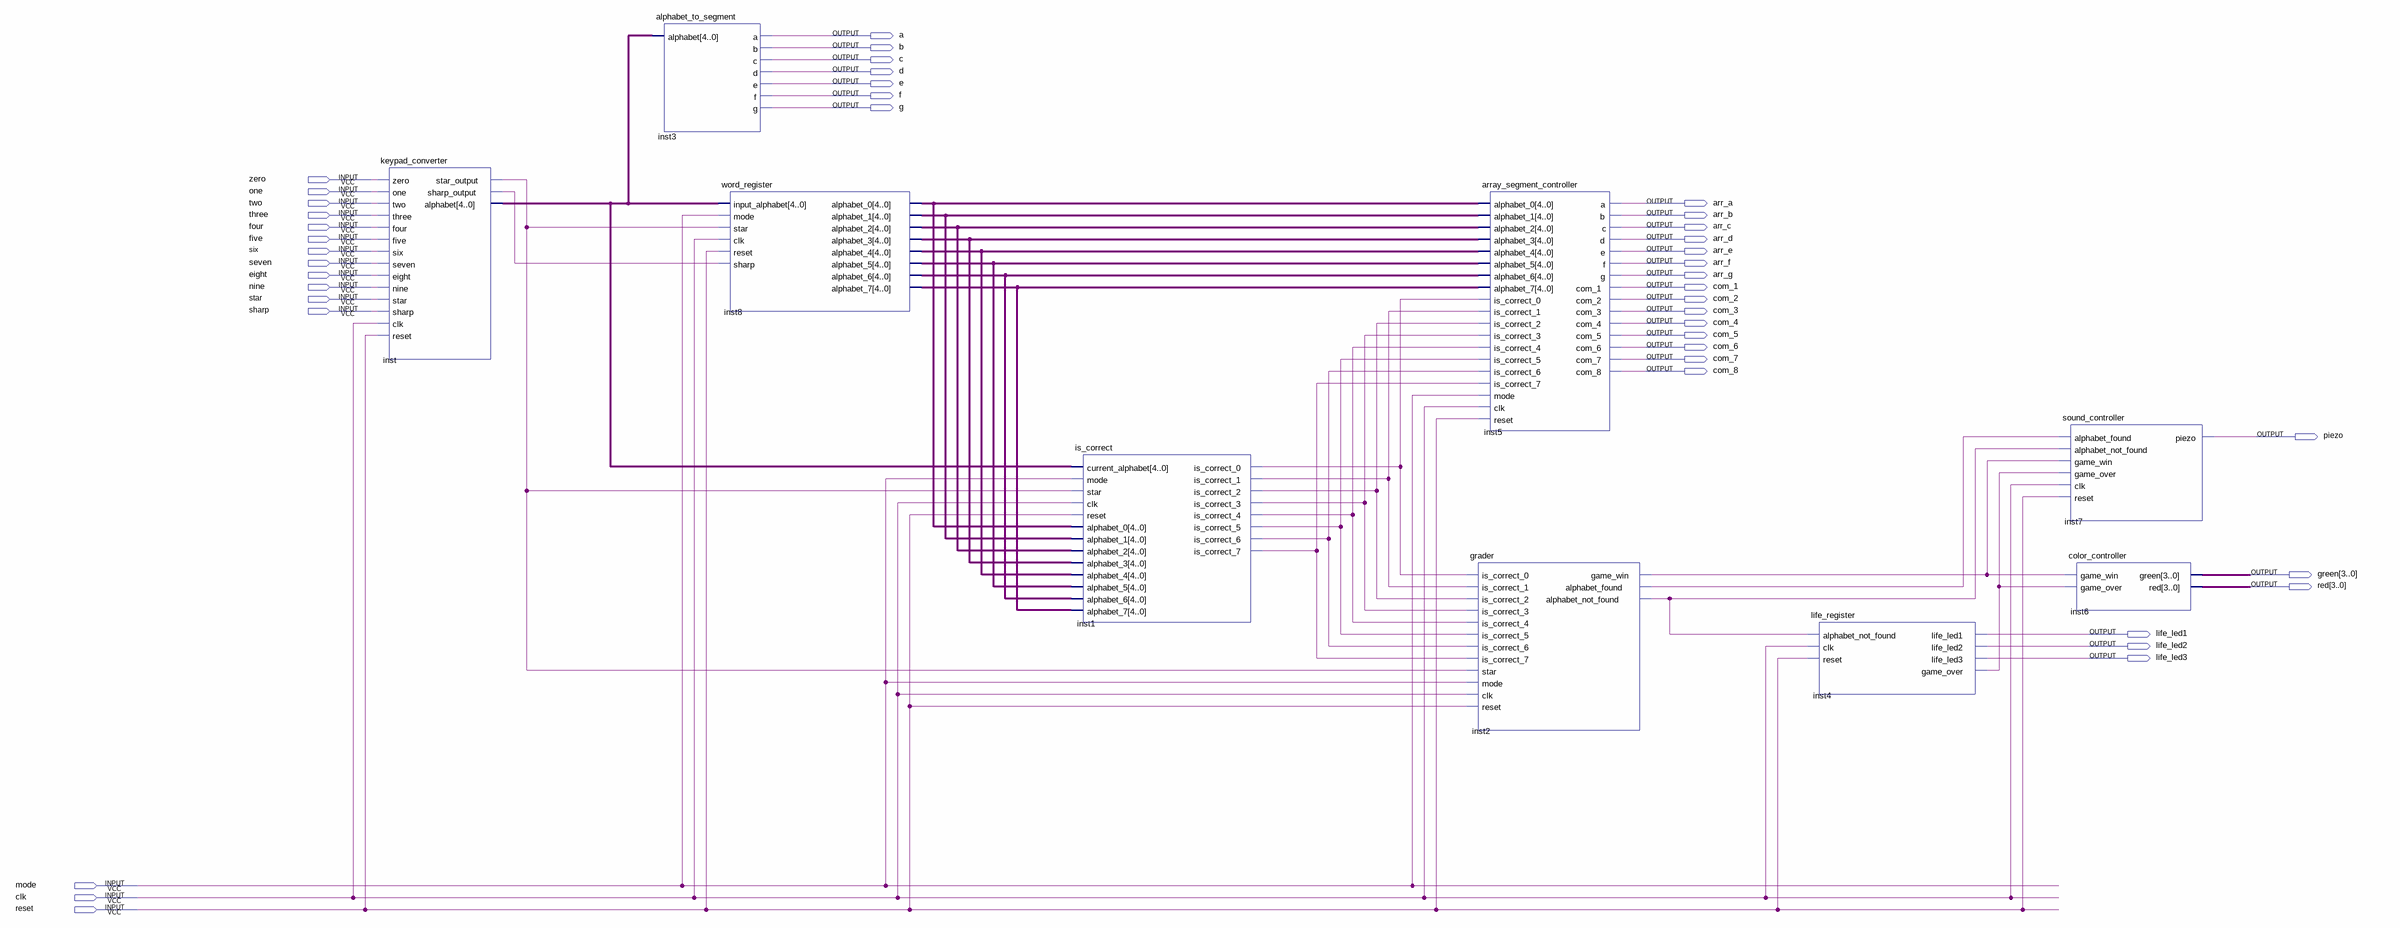
[diagram p0: schematic sheet]
// Quartus schematic hang_man.bdf as structural Verilog: 9 symbols, 43 pins
module hang_man (
  input  zero,
  input  one,
  input  two,
  input  three,
  input  four,
  input  five,
  input  six,
  input  seven,
  input  eight,
  input  nine,
  input  star,
  input  sharp,
  input  mode,
  input  clk,
  input  reset,
  output a,
  output b,
  output c,
  output d,
  output e,
  output f,
  output g,
  output arr_a,
  output arr_b,
  output arr_c,
  output arr_d,
  output arr_e,
  output arr_f,
  output arr_g,
  output com_1,
  output com_2,
  output com_3,
  output com_4,
  output com_5,
  output com_6,
  output com_7,
  output com_8,
  output piezo,
  output [3:0] green,
  output [3:0] red,
  output life_led1,
  output life_led2,
  output life_led3
);

  wire inst1_is_correct_0, inst1_is_correct_1, inst1_is_correct_2, inst1_is_correct_3, inst1_is_correct_4,
       inst1_is_correct_5, inst1_is_correct_6, inst1_is_correct_7, inst2_alphabet_found,
       inst2_alphabet_not_found, inst2_game_win, inst4_game_over, inst_sharp_output, inst_star_output;
  wire [4:0] inst8_alphabet_0, inst8_alphabet_1, inst8_alphabet_2, inst8_alphabet_3, inst8_alphabet_4,
       inst8_alphabet_5, inst8_alphabet_6, inst8_alphabet_7, inst_alphabet;

  keypad_converter inst (
    .zero(zero), .one(one), .two(two), .three(three), .four(four), .five(five), .six(six), .seven(seven),
    .eight(eight), .nine(nine), .star(star), .sharp(sharp), .clk(clk), .reset(reset),
    .star_output(inst_star_output), .sharp_output(inst_sharp_output), .alphabet(inst_alphabet));
  alphabet_to_segment inst3 (.alphabet(inst_alphabet), .a(a), .b(b), .c(c), .d(d), .e(e), .f(f), .g(g));
  word_register inst8 (
    .input_alphabet(inst_alphabet), .mode(mode), .star(inst_star_output), .clk(clk), .reset(reset),
    .sharp(inst_sharp_output), .alphabet_0(inst8_alphabet_0), .alphabet_1(inst8_alphabet_1),
    .alphabet_2(inst8_alphabet_2), .alphabet_3(inst8_alphabet_3), .alphabet_4(inst8_alphabet_4),
    .alphabet_5(inst8_alphabet_5), .alphabet_6(inst8_alphabet_6), .alphabet_7(inst8_alphabet_7));
  is_correct inst1 (
    .current_alphabet(inst_alphabet), .mode(mode), .star(inst_star_output), .clk(clk), .reset(reset),
    .alphabet_0(inst8_alphabet_0), .alphabet_1(inst8_alphabet_1), .alphabet_2(inst8_alphabet_2),
    .alphabet_3(inst8_alphabet_3), .alphabet_4(inst8_alphabet_4), .alphabet_5(inst8_alphabet_5),
    .alphabet_6(inst8_alphabet_6), .alphabet_7(inst8_alphabet_7), .is_correct_0(inst1_is_correct_0),
    .is_correct_1(inst1_is_correct_1), .is_correct_2(inst1_is_correct_2), .is_correct_3(inst1_is_correct_3),
    .is_correct_4(inst1_is_correct_4), .is_correct_5(inst1_is_correct_5), .is_correct_6(inst1_is_correct_6),
    .is_correct_7(inst1_is_correct_7));
  array_segment_controller inst5 (
    .alphabet_0(inst8_alphabet_0), .alphabet_1(inst8_alphabet_1), .alphabet_2(inst8_alphabet_2),
    .alphabet_3(inst8_alphabet_3), .alphabet_4(inst8_alphabet_4), .alphabet_5(inst8_alphabet_5),
    .alphabet_6(inst8_alphabet_6), .alphabet_7(inst8_alphabet_7), .is_correct_0(inst1_is_correct_0),
    .is_correct_1(inst1_is_correct_1), .is_correct_2(inst1_is_correct_2), .is_correct_3(inst1_is_correct_3),
    .is_correct_4(inst1_is_correct_4), .is_correct_5(inst1_is_correct_5), .is_correct_6(inst1_is_correct_6),
    .is_correct_7(inst1_is_correct_7), .mode(mode), .clk(clk), .reset(reset), .a(arr_a), .b(arr_b),
    .c(arr_c), .d(arr_d), .e(arr_e), .f(arr_f), .g(arr_g), .com_1(com_1), .com_2(com_2), .com_3(com_3),
    .com_4(com_4), .com_5(com_5), .com_6(com_6), .com_7(com_7), .com_8(com_8));
  grader inst2 (
    .is_correct_0(inst1_is_correct_0), .is_correct_1(inst1_is_correct_1), .is_correct_2(inst1_is_correct_2),
    .is_correct_3(inst1_is_correct_3), .is_correct_4(inst1_is_correct_4), .is_correct_5(inst1_is_correct_5),
    .is_correct_6(inst1_is_correct_6), .is_correct_7(inst1_is_correct_7), .star(inst_star_output),
    .mode(mode), .clk(clk), .reset(reset), .game_win(inst2_game_win), .alphabet_found(inst2_alphabet_found),
    .alphabet_not_found(inst2_alphabet_not_found));
  life_register inst4 (
    .alphabet_not_found(inst2_alphabet_not_found), .clk(clk), .reset(reset), .life_led1(life_led1),
    .life_led2(life_led2), .life_led3(life_led3), .game_over(inst4_game_over));
  sound_controller inst7 (
    .alphabet_found(inst2_alphabet_found), .alphabet_not_found(inst2_alphabet_not_found),
    .game_win(inst2_game_win), .game_over(inst4_game_over), .clk(clk), .reset(reset), .piezo(piezo));
  color_controller inst6 (.game_win(inst2_game_win), .game_over(inst4_game_over), .green(green), .red(red));
endmodule
